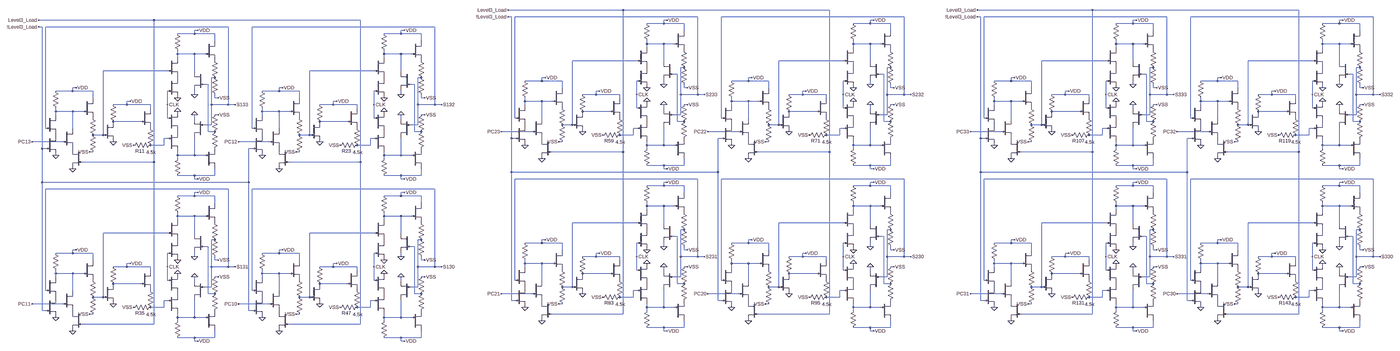
[diagram p0: schematic Level 3.asc, whole sheet]
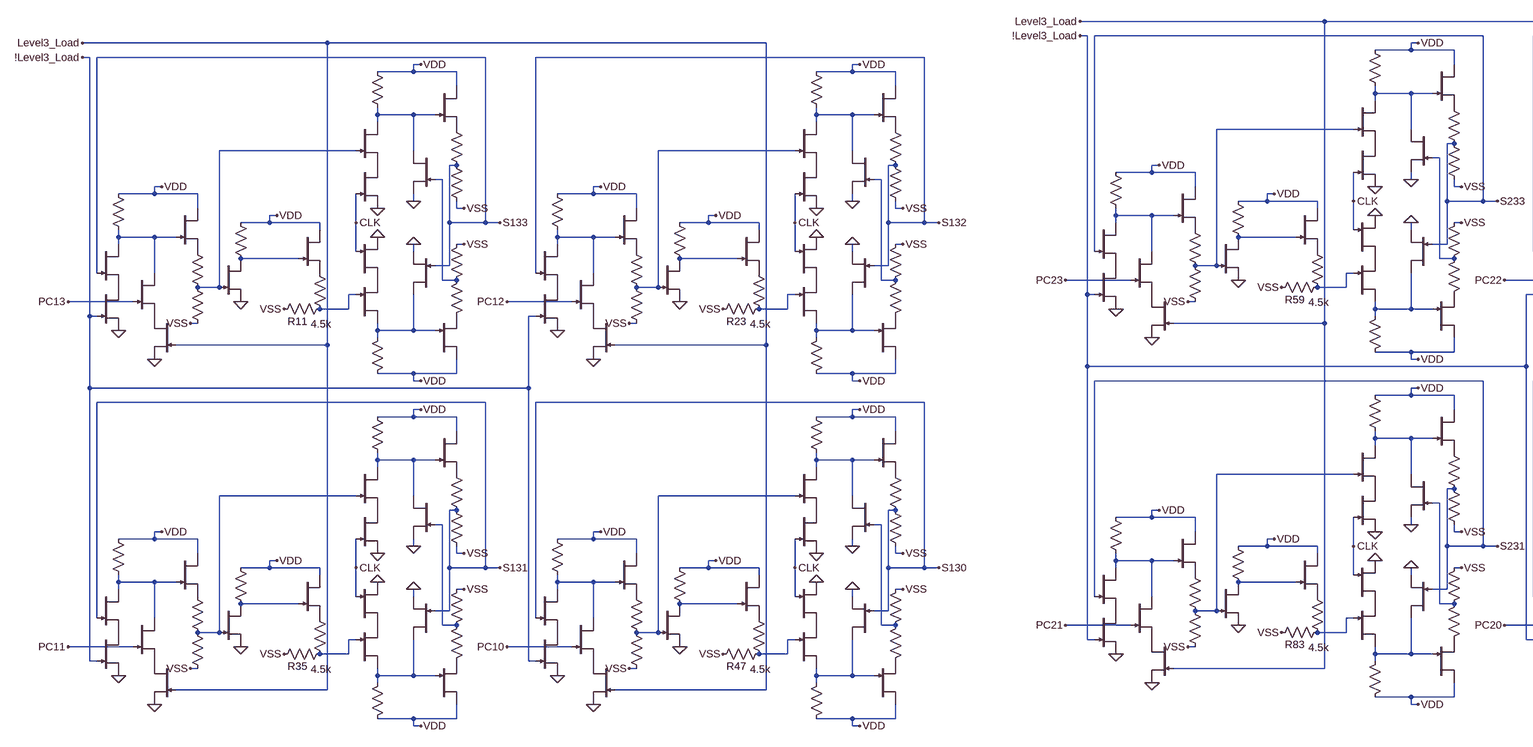
[diagram p1: schematic Level 3.asc, part, row 1 of 1, column 1 of 2]
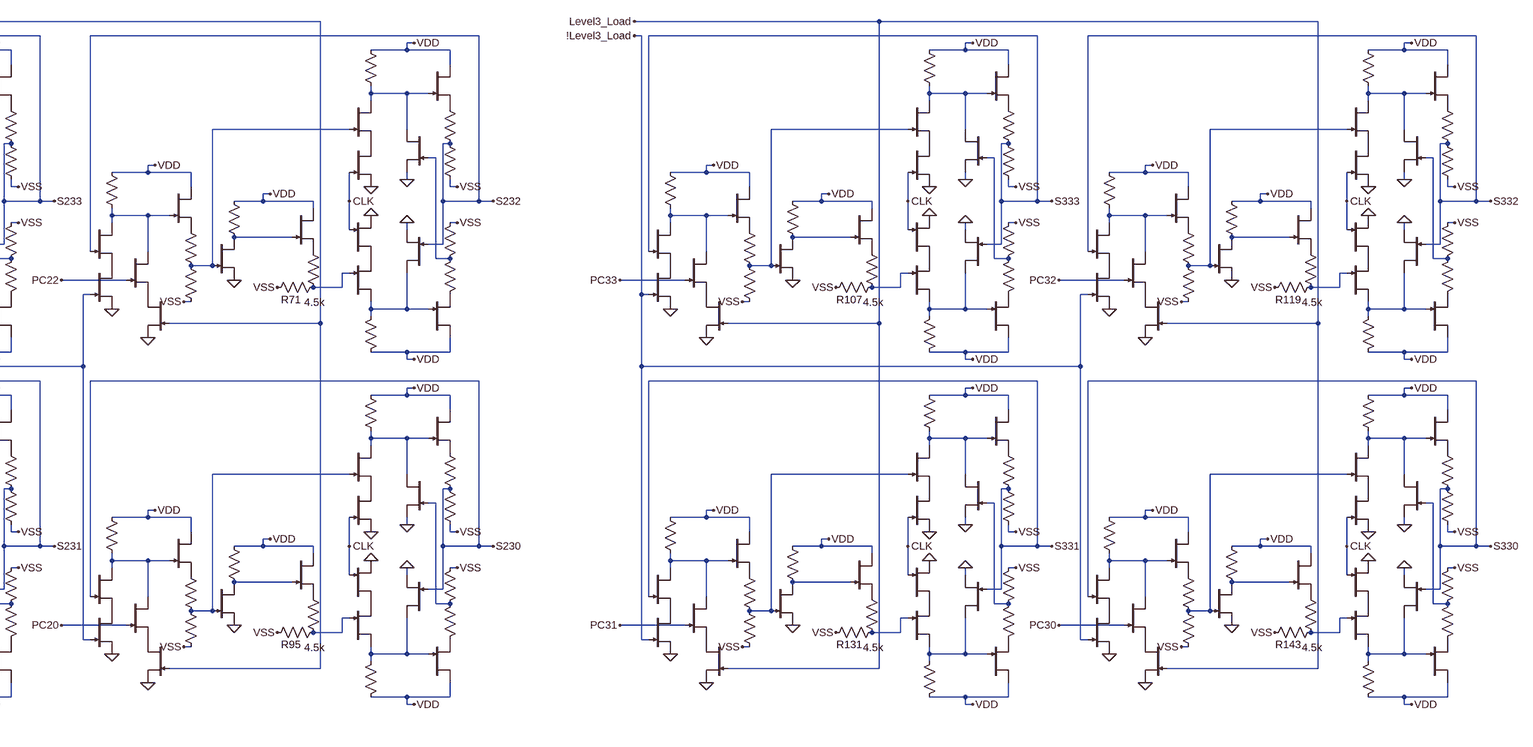
[diagram p2: schematic Level 3.asc, part, row 1 of 1, column 2 of 2]
* Level 3.asc
J0 N005 N011 P001 DR
R0 VDD N005 100k
J1 VDD N005 P002 DR
R1 P002 S133 1k
R2 S133 VSS 4.8k
J2 N005 N017 0 DR
J3 N041 N035 P003 DR
R3 VDD N041 100k
J4 VDD N041 P004 DR
R4 P004 N017 1k
R5 N017 VSS 4.8k
J5 N041 S133 0 DR
J6 P001 CLK 0 DR
J7 P003 CLK 0 DR
J8 N023 S133 P005 DR
R6 VDD N023 100k
J9 VDD N023 P006 DR
R7 P006 N011 1k
R8 N011 VSS 4.8k
J10 N023 PC13 P007 DR
J11 N029 N011 0 DR
R9 VDD N029 50k
J12 VDD N029 P008 DR
R10 P008 N035 1k
R11 N035 VSS 4.5k
J13 P005 !Level3_Load 0 DR
J14 P007 Level3_Load 0 DR
J15 N006 N012 P009 DR
R12 VDD N006 100k
J16 VDD N006 P010 DR
R13 P010 S132 1k
R14 S132 VSS 4.8k
J17 N006 N018 0 DR
J18 N042 N036 P011 DR
R15 VDD N042 100k
J19 VDD N042 P012 DR
R16 P012 N018 1k
R17 N018 VSS 4.8k
J20 N042 S132 0 DR
J21 P009 CLK 0 DR
J22 P011 CLK 0 DR
J23 N024 S132 P013 DR
R18 VDD N024 100k
J24 VDD N024 P014 DR
R19 P014 N012 1k
R20 N012 VSS 4.8k
J25 N024 PC12 P015 DR
J26 N030 N012 0 DR
R21 VDD N030 50k
J27 VDD N030 P016 DR
R22 P016 N036 1k
R23 N036 VSS 4.5k
J28 P013 !Level3_Load 0 DR
J29 P015 Level3_Load 0 DR
J30 N047 N053 P017 DR
R24 VDD N047 100k
J31 VDD N047 P018 DR
R25 P018 S131 1k
R26 S131 VSS 4.8k
J32 N047 N059 0 DR
J33 N083 N077 P019 DR
R27 VDD N083 100k
J34 VDD N083 P020 DR
R28 P020 N059 1k
R29 N059 VSS 4.8k
J35 N083 S131 0 DR
J36 P017 CLK 0 DR
J37 P019 CLK 0 DR
J38 N065 S131 P021 DR
R30 VDD N065 100k
J39 VDD N065 P022 DR
R31 P022 N053 1k
R32 N053 VSS 4.8k
J40 N065 PC11 P023 DR
J41 N071 N053 0 DR
R33 VDD N071 50k
J42 VDD N071 P024 DR
R34 P024 N077 1k
R35 N077 VSS 4.5k
J43 P021 !Level3_Load 0 DR
J44 P023 Level3_Load 0 DR
J45 N048 N054 P025 DR
R36 VDD N048 100k
J46 VDD N048 P026 DR
R37 P026 S130 1k
R38 S130 VSS 4.8k
J47 N048 N060 0 DR
J48 N084 N078 P027 DR
R39 VDD N084 100k
J49 VDD N084 P028 DR
R40 P028 N060 1k
R41 N060 VSS 4.8k
J50 N084 S130 0 DR
J51 P025 CLK 0 DR
J52 P027 CLK 0 DR
J53 N066 S130 P029 DR
R42 VDD N066 100k
J54 VDD N066 P030 DR
R43 P030 N054 1k
R44 N054 VSS 4.8k
J55 N066 PC10 P031 DR
J56 N072 N054 0 DR
R45 VDD N072 50k
J57 VDD N072 P032 DR
R46 P032 N078 1k
R47 N078 VSS 4.5k
J58 P029 !Level3_Load 0 DR
J59 P031 Level3_Load 0 DR
J60 N001 N007 P033 DR
R48 VDD N001 100k
J61 VDD N001 P034 DR
R49 P034 S233 1k
R50 S233 VSS 4.8k
J62 N001 N013 0 DR
J63 N037 N031 P035 DR
R51 VDD N037 100k
J64 VDD N037 P036 DR
R52 P036 N013 1k
R53 N013 VSS 4.8k
J65 N037 S233 0 DR
J66 P033 CLK 0 DR
J67 P035 CLK 0 DR
J68 N019 S233 P037 DR
R54 VDD N019 100k
J69 VDD N019 P038 DR
R55 P038 N007 1k
R56 N007 VSS 4.8k
J70 N019 PC23 P039 DR
J71 N025 N007 0 DR
R57 VDD N025 50k
J72 VDD N025 P040 DR
R58 P040 N031 1k
R59 N031 VSS 4.5k
J73 P037 !Level3_Load 0 DR
J74 P039 Level3_Load 0 DR
J75 N002 N008 P041 DR
R60 VDD N002 100k
J76 VDD N002 P042 DR
R61 P042 S232 1k
R62 S232 VSS 4.8k
J77 N002 N014 0 DR
J78 N038 N032 P043 DR
R63 VDD N038 100k
J79 VDD N038 P044 DR
R64 P044 N014 1k
R65 N014 VSS 4.8k
J80 N038 S232 0 DR
J81 P041 CLK 0 DR
J82 P043 CLK 0 DR
J83 N020 S232 P045 DR
R66 VDD N020 100k
J84 VDD N020 P046 DR
R67 P046 N008 1k
R68 N008 VSS 4.8k
J85 N020 PC22 P047 DR
J86 N026 N008 0 DR
R69 VDD N026 50k
J87 VDD N026 P048 DR
R70 P048 N032 1k
R71 N032 VSS 4.5k
J88 P045 !Level3_Load 0 DR
J89 P047 Level3_Load 0 DR
J90 N043 N049 P049 DR
R72 VDD N043 100k
J91 VDD N043 P050 DR
R73 P050 S231 1k
R74 S231 VSS 4.8k
J92 N043 N055 0 DR
J93 N079 N073 P051 DR
R75 VDD N079 100k
J94 VDD N079 P052 DR
R76 P052 N055 1k
R77 N055 VSS 4.8k
J95 N079 S231 0 DR
J96 P049 CLK 0 DR
J97 P051 CLK 0 DR
J98 N061 S231 P053 DR
R78 VDD N061 100k
J99 VDD N061 P054 DR
R79 P054 N049 1k
R80 N049 VSS 4.8k
J100 N061 PC21 P055 DR
J101 N067 N049 0 DR
R81 VDD N067 50k
J102 VDD N067 P056 DR
R82 P056 N073 1k
R83 N073 VSS 4.5k
J103 P053 !Level3_Load 0 DR
J104 P055 Level3_Load 0 DR
J105 N044 N050 P057 DR
R84 VDD N044 100k
J106 VDD N044 P058 DR
R85 P058 S230 1k
R86 S230 VSS 4.8k
J107 N044 N056 0 DR
J108 N080 N074 P059 DR
R87 VDD N080 100k
J109 VDD N080 P060 DR
R88 P060 N056 1k
R89 N056 VSS 4.8k
J110 N080 S230 0 DR
J111 P057 CLK 0 DR
J112 P059 CLK 0 DR
J113 N062 S230 P061 DR
R90 VDD N062 100k
J114 VDD N062 P062 DR
R91 P062 N050 1k
R92 N050 VSS 4.8k
J115 N062 PC20 P063 DR
J116 N068 N050 0 DR
R93 VDD N068 50k
J117 VDD N068 P064 DR
R94 P064 N074 1k
R95 N074 VSS 4.5k
J118 P061 !Level3_Load 0 DR
J119 P063 Level3_Load 0 DR
J120 N003 N009 P065 DR
R96 VDD N003 100k
J121 VDD N003 P066 DR
R97 P066 S333 1k
R98 S333 VSS 4.8k
J122 N003 N015 0 DR
J123 N039 N033 P067 DR
R99 VDD N039 100k
J124 VDD N039 P068 DR
R100 P068 N015 1k
R101 N015 VSS 4.8k
J125 N039 S333 0 DR
J126 P065 CLK 0 DR
J127 P067 CLK 0 DR
J128 N021 S333 P069 DR
R102 VDD N021 100k
J129 VDD N021 P070 DR
R103 P070 N009 1k
R104 N009 VSS 4.8k
J130 N021 PC33 P071 DR
J131 N027 N009 0 DR
R105 VDD N027 50k
J132 VDD N027 P072 DR
R106 P072 N033 1k
R107 N033 VSS 4.5k
J133 P069 !Level3_Load 0 DR
J134 P071 Level3_Load 0 DR
J135 N004 N010 P073 DR
R108 VDD N004 100k
J136 VDD N004 P074 DR
R109 P074 S332 1k
R110 S332 VSS 4.8k
J137 N004 N016 0 DR
J138 N040 N034 P075 DR
R111 VDD N040 100k
J139 VDD N040 P076 DR
R112 P076 N016 1k
R113 N016 VSS 4.8k
J140 N040 S332 0 DR
J141 P073 CLK 0 DR
J142 P075 CLK 0 DR
J143 N022 S332 P077 DR
R114 VDD N022 100k
J144 VDD N022 P078 DR
R115 P078 N010 1k
R116 N010 VSS 4.8k
J145 N022 PC32 P079 DR
J146 N028 N010 0 DR
R117 VDD N028 50k
J147 VDD N028 P080 DR
R118 P080 N034 1k
R119 N034 VSS 4.5k
J148 P077 !Level3_Load 0 DR
J149 P079 Level3_Load 0 DR
J150 N045 N051 P081 DR
R120 VDD N045 100k
J151 VDD N045 P082 DR
R121 P082 S331 1k
R122 S331 VSS 4.8k
J152 N045 N057 0 DR
J153 N081 N075 P083 DR
R123 VDD N081 100k
J154 VDD N081 P084 DR
R124 P084 N057 1k
R125 N057 VSS 4.8k
J155 N081 S331 0 DR
J156 P081 CLK 0 DR
J157 P083 CLK 0 DR
J158 N063 S331 P085 DR
R126 VDD N063 100k
J159 VDD N063 P086 DR
R127 P086 N051 1k
R128 N051 VSS 4.8k
J160 N063 PC31 P087 DR
J161 N069 N051 0 DR
R129 VDD N069 50k
J162 VDD N069 P088 DR
R130 P088 N075 1k
R131 N075 VSS 4.5k
J163 P085 !Level3_Load 0 DR
J164 P087 Level3_Load 0 DR
J165 N046 N052 P089 DR
R132 VDD N046 100k
J166 VDD N046 P090 DR
R133 P090 S330 1k
R134 S330 VSS 4.8k
J167 N046 N058 0 DR
J168 N082 N076 P091 DR
R135 VDD N082 100k
J169 VDD N082 P092 DR
R136 P092 N058 1k
R137 N058 VSS 4.8k
J170 N082 S330 0 DR
J171 P089 CLK 0 DR
J172 P091 CLK 0 DR
J173 N064 S330 P093 DR
R138 VDD N064 100k
J174 VDD N064 P094 DR
R139 P094 N052 1k
R140 N052 VSS 4.8k
J175 N064 PC30 P095 DR
J176 N070 N052 0 DR
R141 VDD N070 50k
J177 VDD N070 P096 DR
R142 P096 N076 1k
R143 N076 VSS 4.5k
J178 P093 !Level3_Load 0 DR
J179 P095 Level3_Load 0 DR
.model NJF NJF
.model PJF PJF
.lib standard.jft
.backanno
.end